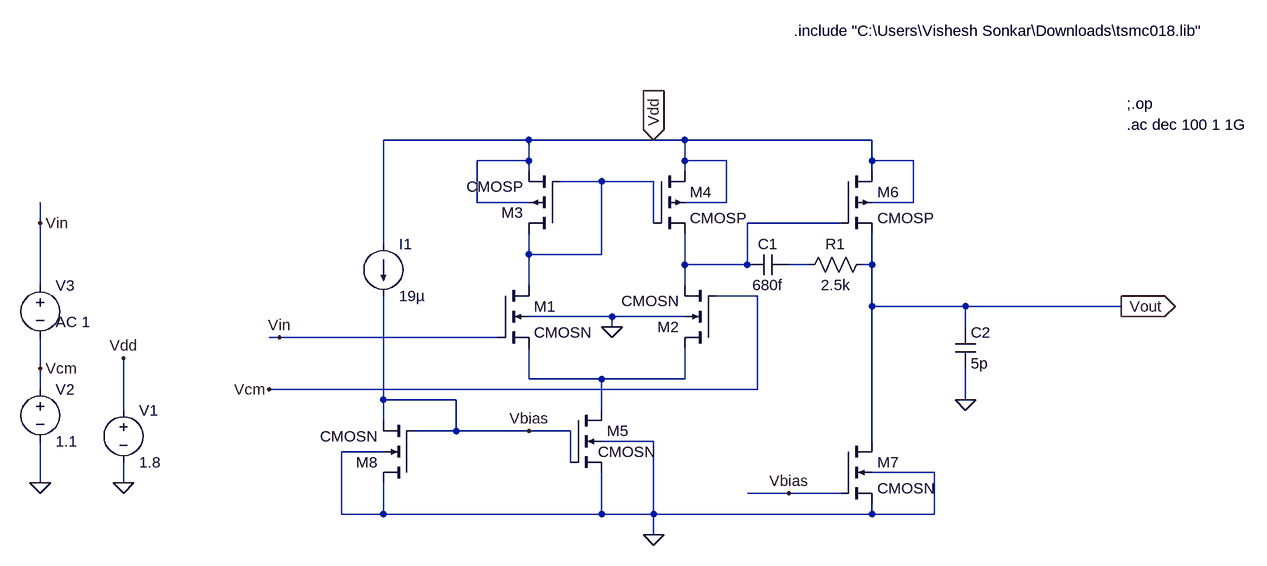
[diagram p0: schematic schematic (2).asc]
schematic (2).asc, the LTspice schematic file:
Version 4.1
SHEET 1 1292 680
WIRE 144 -128 -80 -128
WIRE 336 -128 144 -128
WIRE 384 -128 336 -128
WIRE 672 -128 384 -128
WIRE 144 -96 144 -128
WIRE 144 -96 64 -96
WIRE 384 -96 384 -128
WIRE 448 -96 384 -96
WIRE 672 -96 672 -128
WIRE 736 -96 672 -96
WIRE 144 -80 144 -96
WIRE 384 -80 384 -96
WIRE 672 -80 672 -96
WIRE 256 -64 192 -64
WIRE 336 -64 256 -64
WIRE 64 -32 64 -96
WIRE 144 -32 64 -32
WIRE 448 -32 448 -96
WIRE 448 -32 384 -32
WIRE 736 -32 736 -96
WIRE 736 -32 672 -32
WIRE -608 0 -608 -32
WIRE 336 0 336 -64
WIRE 624 0 480 0
WIRE -80 32 -80 -128
WIRE 144 48 144 16
WIRE 256 48 256 -64
WIRE 256 48 144 48
WIRE 384 64 384 16
WIRE 480 64 480 0
WIRE 480 64 384 64
WIRE 576 64 544 64
WIRE 672 64 672 16
WIRE 672 64 656 64
WIRE -608 96 -608 0
WIRE 144 96 144 48
WIRE 384 96 384 64
WIRE 496 112 432 112
WIRE 672 128 672 64
WIRE 816 128 672 128
WIRE 1056 128 816 128
WIRE 272 144 144 144
WIRE 384 144 272 144
WIRE 272 160 272 144
WIRE 816 160 816 128
WIRE -240 176 -256 176
WIRE 96 176 -240 176
WIRE -608 224 -608 176
WIRE 144 240 144 192
WIRE 256 240 144 240
WIRE 384 240 384 192
WIRE 384 240 256 240
WIRE -608 256 -608 224
WIRE 496 256 496 112
WIRE 496 256 -256 256
WIRE -80 272 -80 112
WIRE 32 272 -80 272
WIRE 816 272 816 224
WIRE -480 288 -480 208
WIRE 256 288 256 240
WIRE -80 304 -80 272
WIRE 32 320 32 272
WIRE 32 320 -32 320
WIRE 144 320 32 320
WIRE 208 320 144 320
WIRE 336 336 256 336
WIRE 672 336 672 128
WIRE -80 352 -144 352
WIRE 208 368 208 320
WIRE 768 384 672 384
WIRE -608 400 -608 336
WIRE -480 400 -480 368
WIRE 544 416 480 416
WIRE 624 416 544 416
WIRE -144 448 -144 352
WIRE -80 448 -80 400
WIRE -80 448 -144 448
WIRE 256 448 256 384
WIRE 256 448 -80 448
WIRE 336 448 336 336
WIRE 336 448 256 448
WIRE 672 448 672 432
WIRE 672 448 336 448
WIRE 768 448 768 384
WIRE 768 448 672 448
WIRE 336 480 336 448
FLAG 816 272 0
FLAG 272 160 0
FLAG 336 -128 Vdd
IOPIN 336 -128 In
FLAG -480 400 0
FLAG -608 400 0
FLAG -480 208 Vdd
FLAG -256 256 Vcm
FLAG -608 224 Vcm
FLAG 1056 128 Vout
IOPIN 1056 128 Out
FLAG 144 320 Vbias
FLAG 544 416 Vbias
FLAG 336 480 0
FLAG -240 176 Vin
FLAG -608 0 Vin
SYMBOL nmos4 96 96 R0
SYMATTR InstName M1
SYMATTR Value2 l=0.45u w=3.87u
SYMATTR Value CMOSN
SYMBOL nmos4 432 192 R180
SYMATTR InstName M2
SYMATTR Value2 l=0.45u w=3.87u
SYMATTR Value CMOSN
SYMBOL nmos4 208 288 R0
WINDOW 3 42 64 Left 2
SYMATTR Value CMOSN
SYMATTR InstName M5
SYMATTR Value2 l=0.54u w=3.51u
SYMBOL nmos4 624 336 R0
SYMATTR InstName M7
SYMATTR Value2 l=0.5u w=28u
SYMATTR Value CMOSN
SYMBOL nmos4 -32 400 R180
SYMATTR InstName M8
SYMATTR Value2 l=0.54u w=3.51u
SYMATTR Value CMOSN
SYMBOL pmos4 192 16 R180
SYMATTR InstName M3
SYMATTR Value2 l=.54u w=5.13u
SYMATTR Value CMOSP
SYMBOL pmos4 336 -80 R0
SYMATTR InstName M4
SYMATTR Value2 l=0.54u w=5.13u
SYMATTR Value CMOSP
SYMBOL pmos4 624 -80 R0
SYMATTR InstName M6
SYMATTR Value2 l=0.5u w=80u
SYMATTR Value CMOSP
SYMBOL cap 800 160 R0
SYMATTR InstName C2
SYMATTR Value 5p
SYMBOL current -80 32 R0
WINDOW 123 0 0 Left 0
WINDOW 39 0 0 Left 0
SYMATTR InstName I1
SYMATTR Value 19µ
SYMBOL voltage -480 272 R0
SYMATTR InstName V1
SYMATTR Value 1.8
SYMBOL voltage -608 240 R0
SYMATTR InstName V2
SYMATTR Value 1.1
SYMBOL voltage -608 80 R0
WINDOW 3 24 44 Left 2
WINDOW 123 24 72 Left 2
WINDOW 39 0 0 Left 0
SYMATTR Value ""
SYMATTR Value2 AC 1
SYMATTR InstName V3
SYMBOL cap 544 48 R90
WINDOW 0 0 32 VBottom 2
WINDOW 3 32 32 VTop 2
SYMATTR InstName C1
SYMATTR Value 680f
SYMBOL res 672 48 R90
WINDOW 0 0 56 VBottom 2
WINDOW 3 32 56 VTop 2
SYMATTR InstName R1
SYMATTR Value 2.5k
TEXT 552 -296 Left 2 !.include "C:\\Users\\Vishesh Sonkar\\Downloads\\tsmc018.lib"
TEXT 1064 -152 Left 2 !.ac dec 100 1 1G
TEXT 1064 -184 Left 2 !;.op

The netlist it stands for:
* schematic (2).asc
M1 N001 Vin N004 0 CMOSN l=0.45u w=3.87u
M2 N004 Vcm N002 0 CMOSN l=0.45u w=3.87u
M5 N004 Vbias 0 0 CMOSN l=0.54u w=3.51u
M7 Vout Vbias 0 0 CMOSN l=0.5u w=28u
M8 0 Vbias Vbias 0 CMOSN l=0.54u w=3.51u
M3 N001 N001 Vdd Vdd CMOSP l=.54u w=5.13u
M4 Vdd N001 N002 Vdd CMOSP l=0.54u w=5.13u
M6 Vdd N002 Vout Vdd CMOSP l=0.5u w=80u
C2 Vout 0 5p
I1 Vdd Vbias 19µ
V1 Vdd 0 1.8
V2 Vcm 0 1.1
V3 Vin Vcm AC 1
C1 N003 N002 680f
R1 Vout N003 2.5k
.model NMOS NMOS
.model PMOS PMOS
.lib standard.mos
.include "C:\Users\Vishesh Sonkar\Downloads\tsmc018.lib"
.ac dec 100 1 1G
;.op
.backanno
.end